# EasyEDA schematic SCH_project_BMO_2026-04-16.json

## Sheets
1 Sheet_1: TITLE: BMO; REV: 1.0; Date: 2026-03-21; Sheet: 1/1; Drawn By: jeanzzinho123456; Company: Your Company
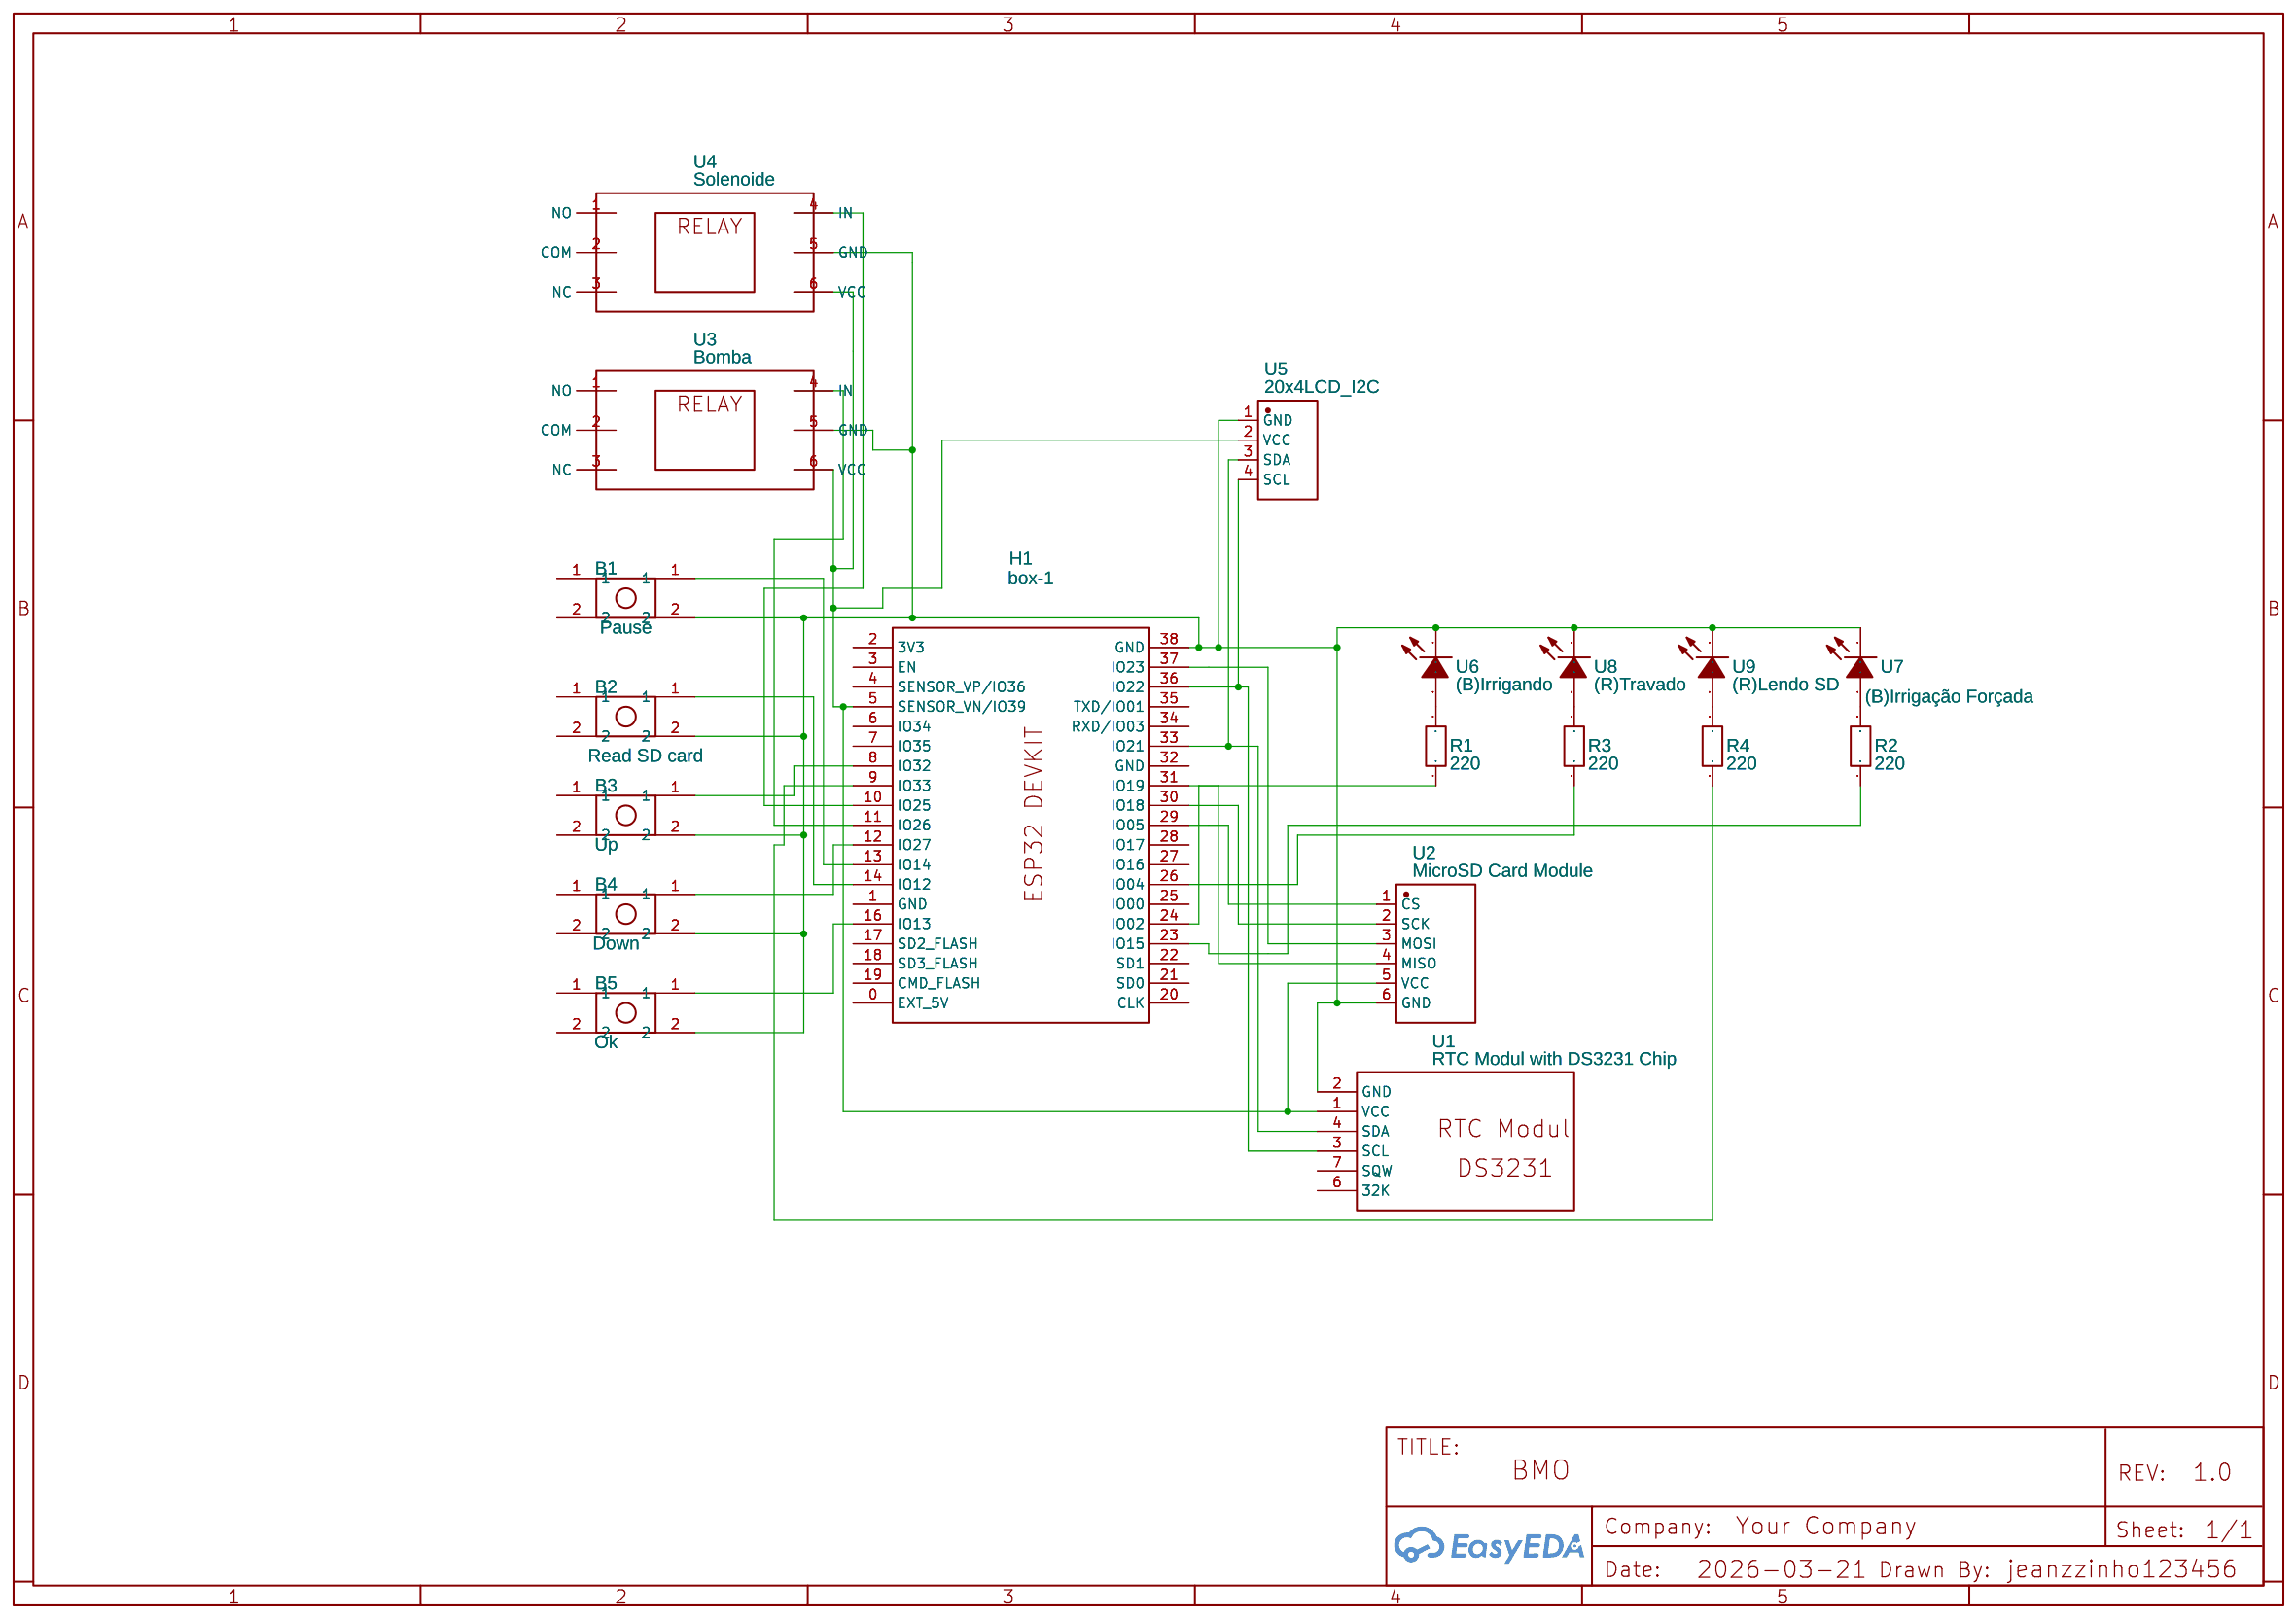
[diagram p0: Sheet_1]
2 1L_BMOSheet_2
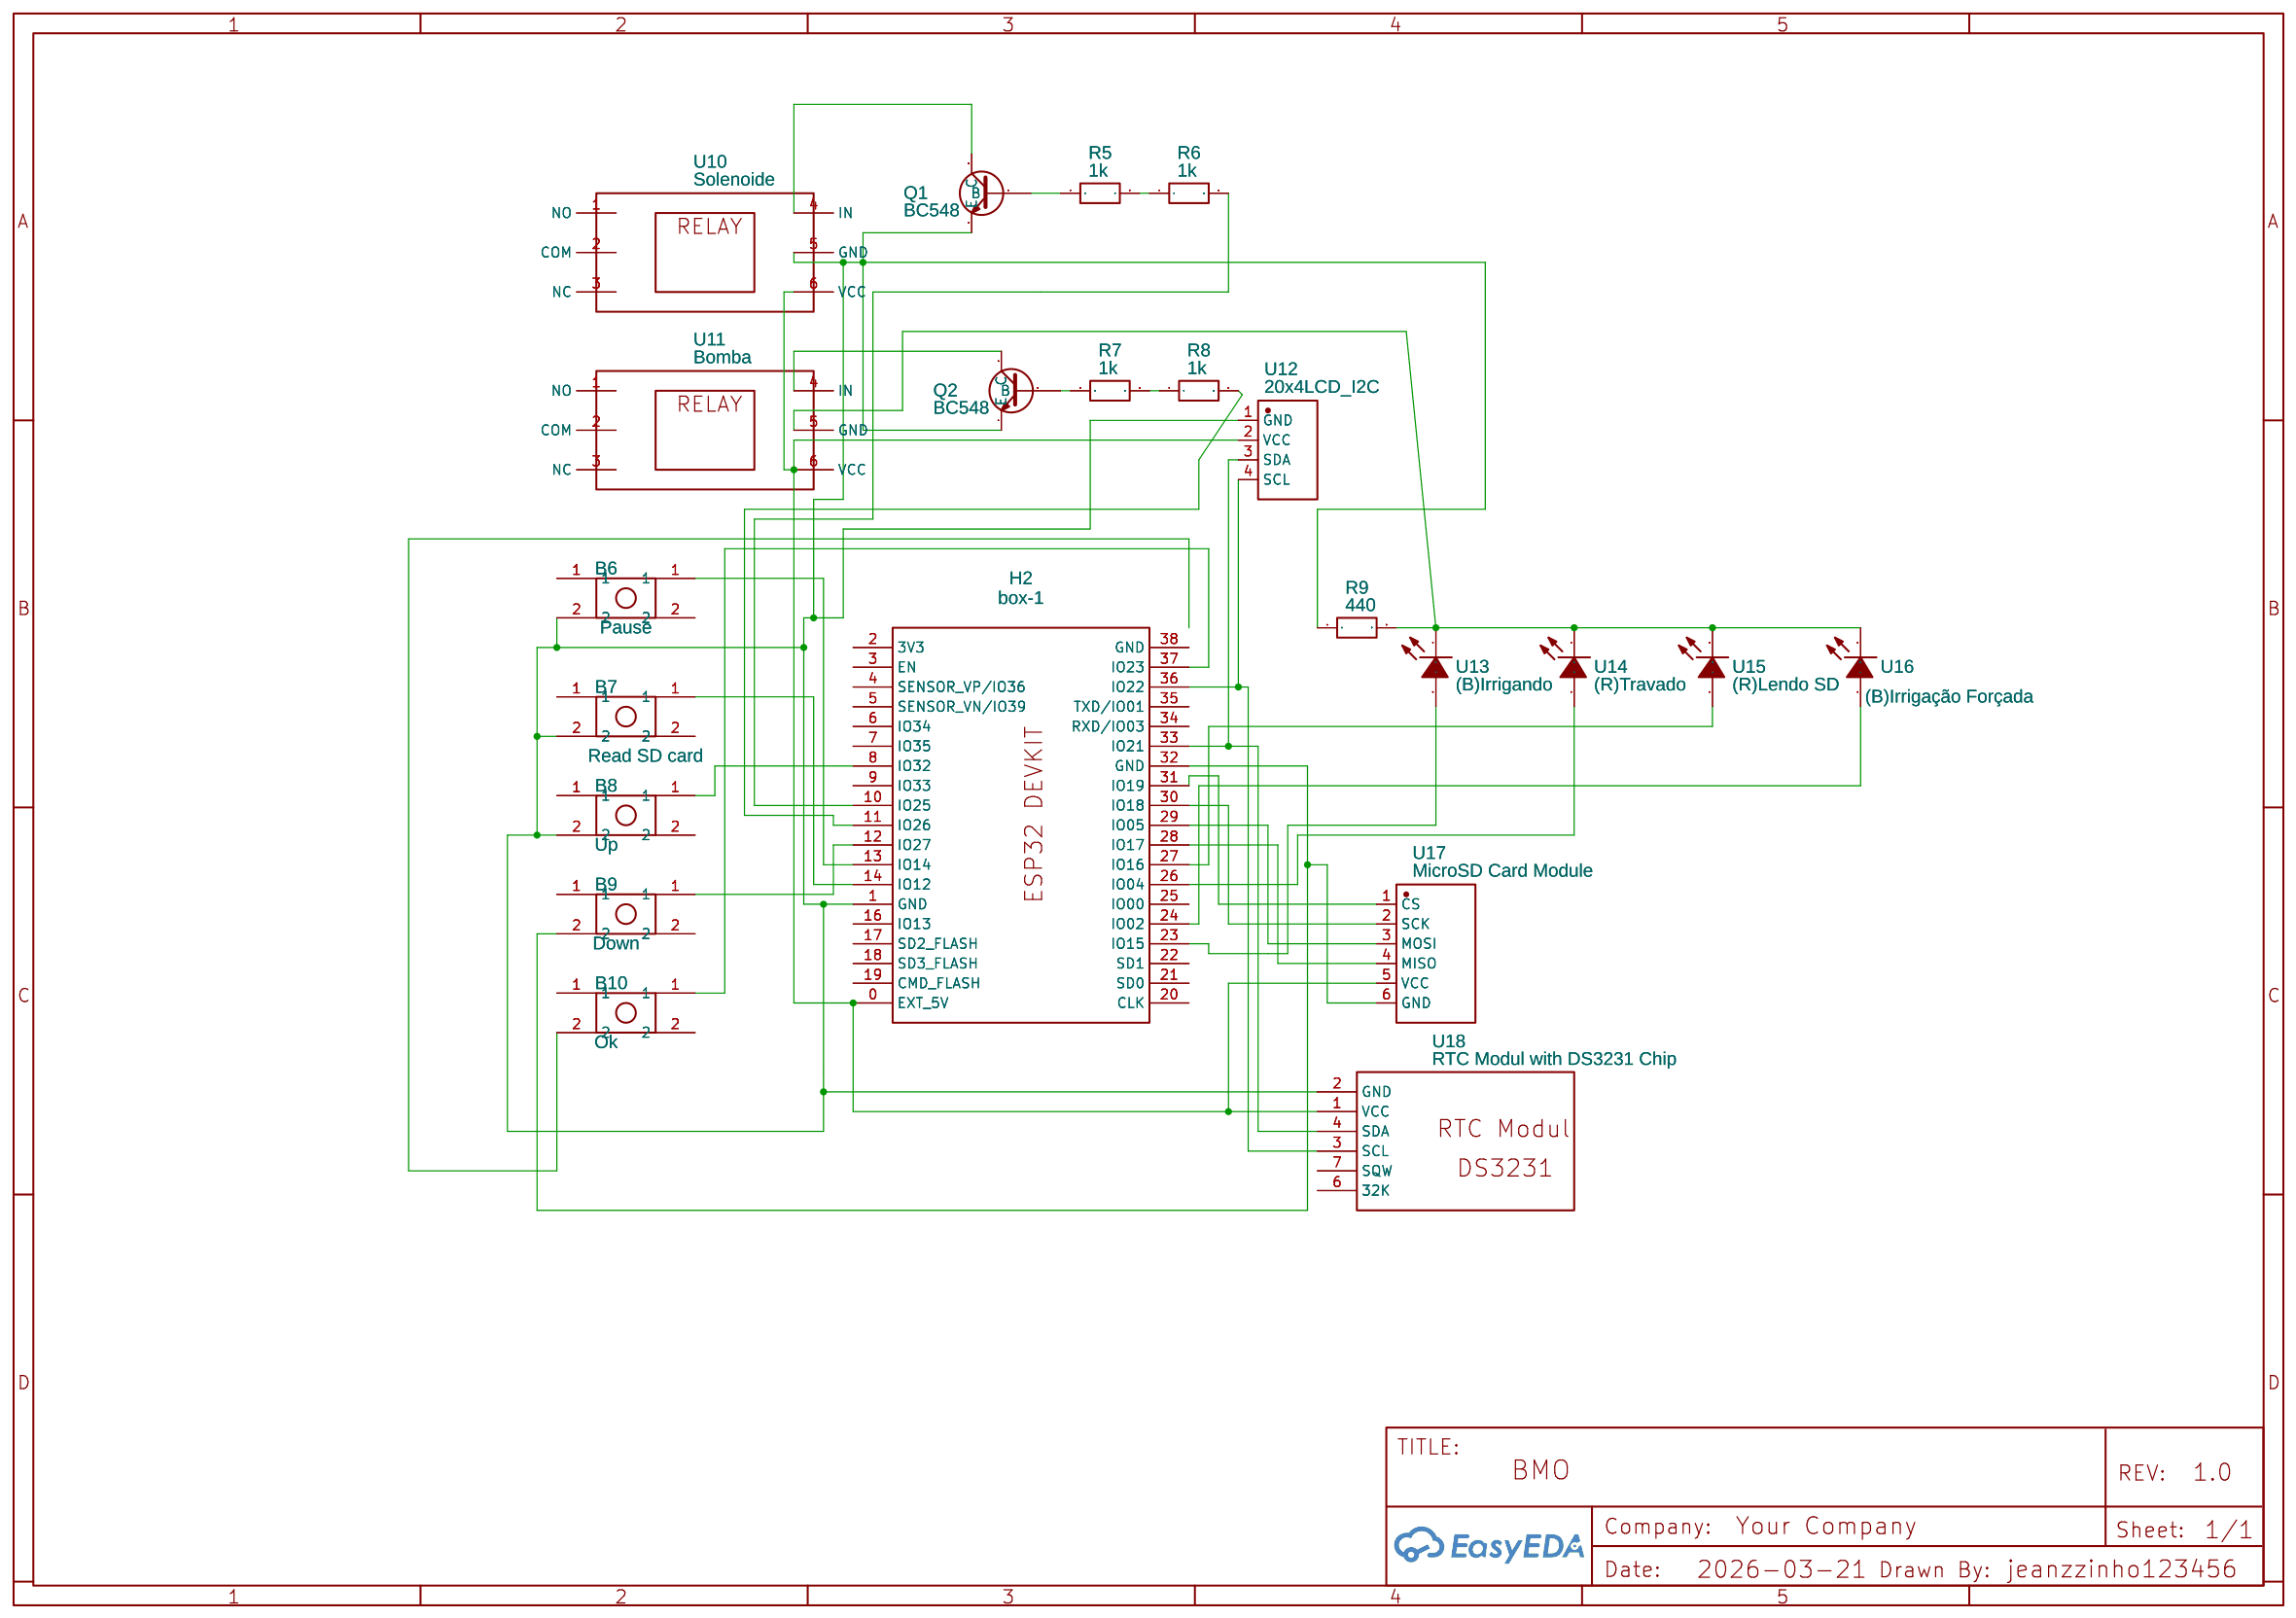
[diagram p1: 1L_BMOSheet_2]

## Parts
sheet 1L_BMOSheet_2
B6  Pause  [PUSH-BUTTOM SMD 6*6]
B7  Read SD card  [PUSH-BUTTOM SMD 6*6]
B8  Up  [PUSH-BUTTOM SMD 6*6]
B9  Down  [PUSH-BUTTOM SMD 6*6]
B10  Ok  [PUSH-BUTTOM SMD 6*6]
H2  box-1  [HEADER-38PINS-FOR-ESP32DEVKIT]
Q1  BC548  [TRANSISTOR-CBE]
Q2  BC548  [TRANSISTOR-CBE]
R5  1k  [R0603]
R6  1k  [R0603]
R7  1k  [R0603]
R8  1k  [R0603]
R9  440  [R0603]
U10  Solenoide  [1 CHANNEL RELAY MODULE]
U11  Bomba  [1 CHANNEL RELAY MODULE]
U12  20x4LCD_I2C  [LCD_20X4_4PINS]
U13  (B)Irrigando  [LED-SMD_SD65-120-LED]
U14  (R)Travado  [LED-SMD_SD65-120-LED]
U15  (R)Lendo SD  [LED-SMD_SD65-120-LED]
U16  (B)Irrigação Forçada  [LED-SMD_SD65-120-LED]
U17  MicroSD Card Module  [MICROSD-CARD-MODULE-FOOTPRINT]
U18  RTC Modul with DS3231 Chip  [DS3231-RTC-MODULE]
sheet Sheet_1
B1  Pause  [PUSH-BUTTOM SMD 6*6]
B2  Read SD card  [PUSH-BUTTOM SMD 6*6]
B3  Up  [PUSH-BUTTOM SMD 6*6]
B4  Down  [PUSH-BUTTOM SMD 6*6]
B5  Ok  [PUSH-BUTTOM SMD 6*6]
H1  box-1  [HEADER-38PINS-FOR-ESP32DEVKIT]
R1  220  [R0603]
R2  220  [R0603]
R3  220  [R0603]
R4  220  [R0603]
U1  RTC Modul with DS3231 Chip  [DS3231-RTC-MODULE]
U2  MicroSD Card Module  [MICROSD-CARD-MODULE-FOOTPRINT]
U3  Bomba  [1 CHANNEL RELAY MODULE]
U4  Solenoide  [1 CHANNEL RELAY MODULE]
U5  20x4LCD_I2C  [LCD_20X4_4PINS]
U6  (B)Irrigando  [LED-SMD_SD65-120-LED]
U7  (B)Irrigação Forçada  [LED-SMD_SD65-120-LED]
U8  (R)Travado  [LED-SMD_SD65-120-LED]
U9  (R)Lendo SD  [LED-SMD_SD65-120-LED]

## Library data of the parts
B1-B10 = Push-buttom smd 6x6: Contributor: rrluis0
H1 H2 = box-1: Manufacturer: BOOMELE; Manufacturer Part: 2.54mm 1*19P Female header; Supplier: LCSC; Supplier Part: C319202; link: https://lcsc.com/product-detail/Lack-of-specifications_BOOMELE-Boom-Precision-Elec-C319202_C319202.html; Contributor: vongsukorn4906
Q1 Q2 = TRANSISTOR NPN CBE: Contributor: Jayadamski
R1-R9 = R_0603_EU: Contributor: LCEDA_Lib
U3 U4 U10 U11 = 1 CHANNEL RELAY MODULE: Contributor: jyotik.simaria
U5 U12 = 20x4LCD_I2C: Supplier: Amazon; link: https://www.amazon.com/GeeekPi-Interface-Backlight-Raspberry-Electrical/dp/B0B4N1SFV1/ref=sr_1_6?crid=20HS1FGGNZE45&keywords=i2c+lcd+20x4&qid=1695300172&sprefix=i2c+lcd+20x4%2Caps%2C826&sr=8-6
U6-U9 U13-U16 = 720-LCGH9RNMXNX1: Contributor: lcsc; Supplier: LCSC; Supplier Part: C9900019959; Manufacturer: null; JLCPCB Part Class: Extended Part
U2 U17 = MicroSD Card Module: Contributor: ichhabeviele
U1 U18 = RTC Modul with DS3231 Chip: Contributor: Garrisson

## Nets
Net-(B1-1): B1.1 H1.13(IO14)
Net-(B1-2): B1.2 B2.2 B3.2 B4.2 B5.2 H1.38(GND) U1.2(GND) U2.6(GND) U3.5(GND) U4.5(GND) U5.1(GND) U6.1(K) U7.1(K) U8.1(K) U9.1(K)
Net-(B2-1): B2.1 H1.14(IO12)
Net-(B3-1): B3.1 H1.8(IO32)
Net-(B4-1): B4.1 H1.12(IO27)
Net-(B5-1): B5.1 H1.16(IO13)
Net-(B6-1): B6.1 H2.13(IO14)
Net-(B6-2): B6.2 B7.2 B8.2 H2.1(GND) Q1.1(E) Q2.1(E) R9.1 U10.5(GND) U12.1(GND) U18.2(GND)
Net-(B7-1): B7.1 H2.14(IO12)
Net-(B8-1): B8.1 H2.8(IO32)
Net-(B9-1): B9.1 H2.12(IO27)
Net-(B9-2): B9.2 H2.32(GND) U17.6(GND)
Net-(B10-1): B10.1 H2.37(IO23)
Net-(H1-5): H1.5(SENSOR_VN/IO39) U1.1(VCC) U2.5(VCC) U3.6(VCC) U4.6(VCC) U5.2(VCC)
Net-(H1-9): H1.9(IO33) R4.1
Net-(H1-10): H1.10(IO25) U4.4(IN)
Net-(H1-11): H1.11(IO26) U3.4(IN)
Net-(H1-23): H1.23(IO15) R2.1
Net-(H1-24): H1.24(IO02) R1.1
Net-(H1-26): H1.26(IO04) R3.1
Net-(H1-29): H1.29(IO05) U2.1(CS)
Net-(H1-30): H1.30(IO18) U2.2(SCK)
Net-(H1-31): H1.31(IO19) U2.4(MISO)
Net-(H1-33): H1.33(IO21) U1.4(SDA) U5.3(SDA)
Net-(H1-36): H1.36(IO22) U1.3(SCL) U5.4(SCL)
Net-(H1-37): H1.37(IO23) U2.3(MOSI)
Net-(H2-0): H2.0(EXT_5V) U10.6(VCC) U11.6(VCC) U12.2(VCC) U17.5(VCC) U18.1(VCC)
Net-(H2-10): H2.10(IO25) R6.2
Net-(H2-11): H2.11(IO26) R8.2
Net-(H2-23): H2.23(IO15) H2.24(IO02) U13.2(A) U16.2(A)
Net-(H2-26): H2.26(IO04) U14.2(A)
Net-(H2-27): H2.27(IO16) U15.2(A)
Net-(H2-28): H2.28(IO17) U17.4(MISO)
Net-(H2-29): H2.29(IO05) U17.3(MOSI)
Net-(H2-30): H2.30(IO18) U17.2(SCK)
Net-(H2-31): H2.31(IO19) U17.1(CS)
Net-(H2-33): H2.33(IO21) U12.3(SDA) U18.4(SDA)
Net-(H2-36): H2.36(IO22) U12.4(SCL) U18.3(SCL)
Net-(Q1-2): Q1.2(B) R5.1
Net-(Q1-3): Q1.3(C) U10.4(IN)
Net-(Q2-2): Q2.2(B) R7.1
Net-(Q2-3): Q2.3(C) U11.4(IN)
Net-(R1-2): R1.2 U6.2(A)
Net-(R2-2): R2.2 U7.2(A)
Net-(R3-2): R3.2 U8.2(A)
Net-(R4-2): R4.2 U9.2(A)
Net-(R5-2): R5.2 R6.1
Net-(R7-2): R7.2 R8.1
Net-(R9-2): R9.2 U11.5(GND) U13.1(K) U14.1(K) U15.1(K) U16.1(K)

Not connected (* = marked no-connect by the designer): B10 2; H1 0(EXT_5V) 1(GND) 2(3V3) 3(EN) 4(SENSOR_VP/IO36) 6(IO34) 7(IO35) 17(SD2 FLASH) 18(SD3 FLASH) 19(CMD FLASH) 20(CLK) 21(SD0) 22(SD1) 25(IO00) 27(IO16) 28(IO17) 32(GND) 34(RXD/IO03) 35(TXD/IO01); H2 2(3V3) 3(EN) 4(SENSOR_VP/IO36) 5(SENSOR_VN/IO39) 6(IO34) 7(IO35) 9(IO33) 16(IO13) 17(SD2 FLASH) 18(SD3 FLASH) 19(CMD FLASH) 20(CLK) 21(SD0) 22(SD1) 25(IO00) 34(RXD/IO03) 35(TXD/IO01) 38(GND); U1 6(32K) 7(SQW); U3 1(NO) 2(COM) 3(NC); U4 1(NO) 2(COM) 3(NC); U10 1(NO) 2(COM) 3(NC); U11 1(NO) 2(COM) 3(NC); U18 6(32K) 7(SQW)
